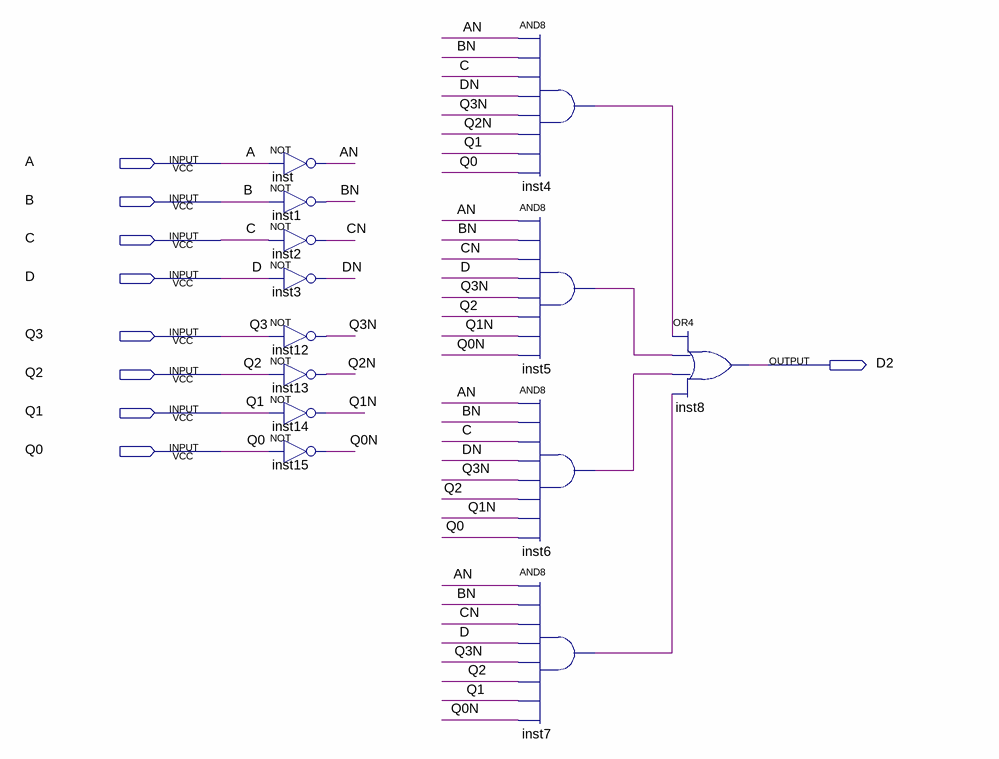
[diagram p0: schematic sheet]
// Quartus schematic D2.bdf as structural Verilog: 13 symbols, 9 pins
module D2 (
  input  A,
  input  B,
  input  C,
  input  D,
  input  Q3,
  input  Q2,
  input  Q1,
  input  Q0,
  output D2
);

  wire AN, BN, CN, DN, inst4_out, inst5_out, inst6_out, inst7_out, Q0N, Q1N, Q2N, Q3N;

  not inst (AN, A);
  not inst1 (BN, B);
  not inst2 (CN, C);
  not inst3 (DN, D);
  not inst12 (Q3N, Q3);
  not inst13 (Q2N, Q2);
  not inst14 (Q1N, Q1);
  not inst15 (Q0N, Q0);
  and inst4 (inst4_out, AN, BN, C, DN, Q3N, Q2N, Q1, Q0);
  and inst5 (inst5_out, AN, BN, CN, D, Q3N, Q2, Q1N, Q0N);
  and inst6 (inst6_out, AN, BN, C, DN, Q3N, Q2, Q1N, Q0);
  and inst7 (inst7_out, AN, BN, CN, D, Q3N, Q2, Q1, Q0N);
  or inst8 (D2, inst4_out, inst5_out, inst6_out, inst7_out);
endmodule
